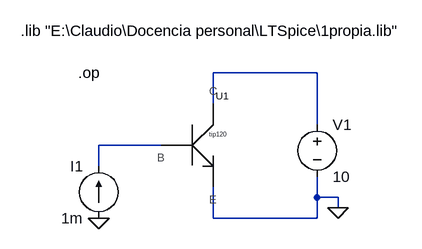
[diagram p0: schematic darlington1.asc]
darlington1.asc, the LTspice schematic file:
Version 4
SHEET 1 916 680
WIRE 720 80 560 80
WIRE 560 128 560 80
WIRE 720 160 720 80
WIRE 480 192 384 192
WIRE 384 224 384 192
WIRE 720 272 720 240
WIRE 752 272 720 272
WIRE 752 288 752 272
WIRE 560 304 560 256
WIRE 720 304 720 272
WIRE 720 304 560 304
FLAG 384 304 0
FLAG 752 288 0
SYMBOL voltage 720 144 R0
WINDOW 123 0 0 Left 0
WINDOW 39 0 0 Left 0
SYMATTR InstName V1
SYMATTR Value 10
SYMBOL current 384 304 R180
WINDOW 0 24 80 Left 2
WINDOW 3 24 0 Left 2
WINDOW 123 0 0 Left 0
WINDOW 39 0 0 Left 0
SYMATTR InstName I1
SYMATTR Value 1m
SYMBOL Darlington\ npn 528 192 R0
SYMATTR Value tip120
SYMATTR InstName U1
TEXT 264 16 Left 2 !.lib "E:\\Claudio\\Docencia personal\\LTSpice\\1propia.lib"
TEXT 352 80 Left 2 !.op

The netlist it stands for:
* darlington1.asc
V1 N001 0 10
I1 0 N002 1m
XU1 N001 N002 0 tip120  ; pins C B E
.lib "E:\Claudio\Docencia personal\LTSpice\1propia.lib"
.op
.backanno
.end